# EAGLE schematic MicroMod-Ethernet-Function-Board-W5500 (EAGLE 9.6.2)
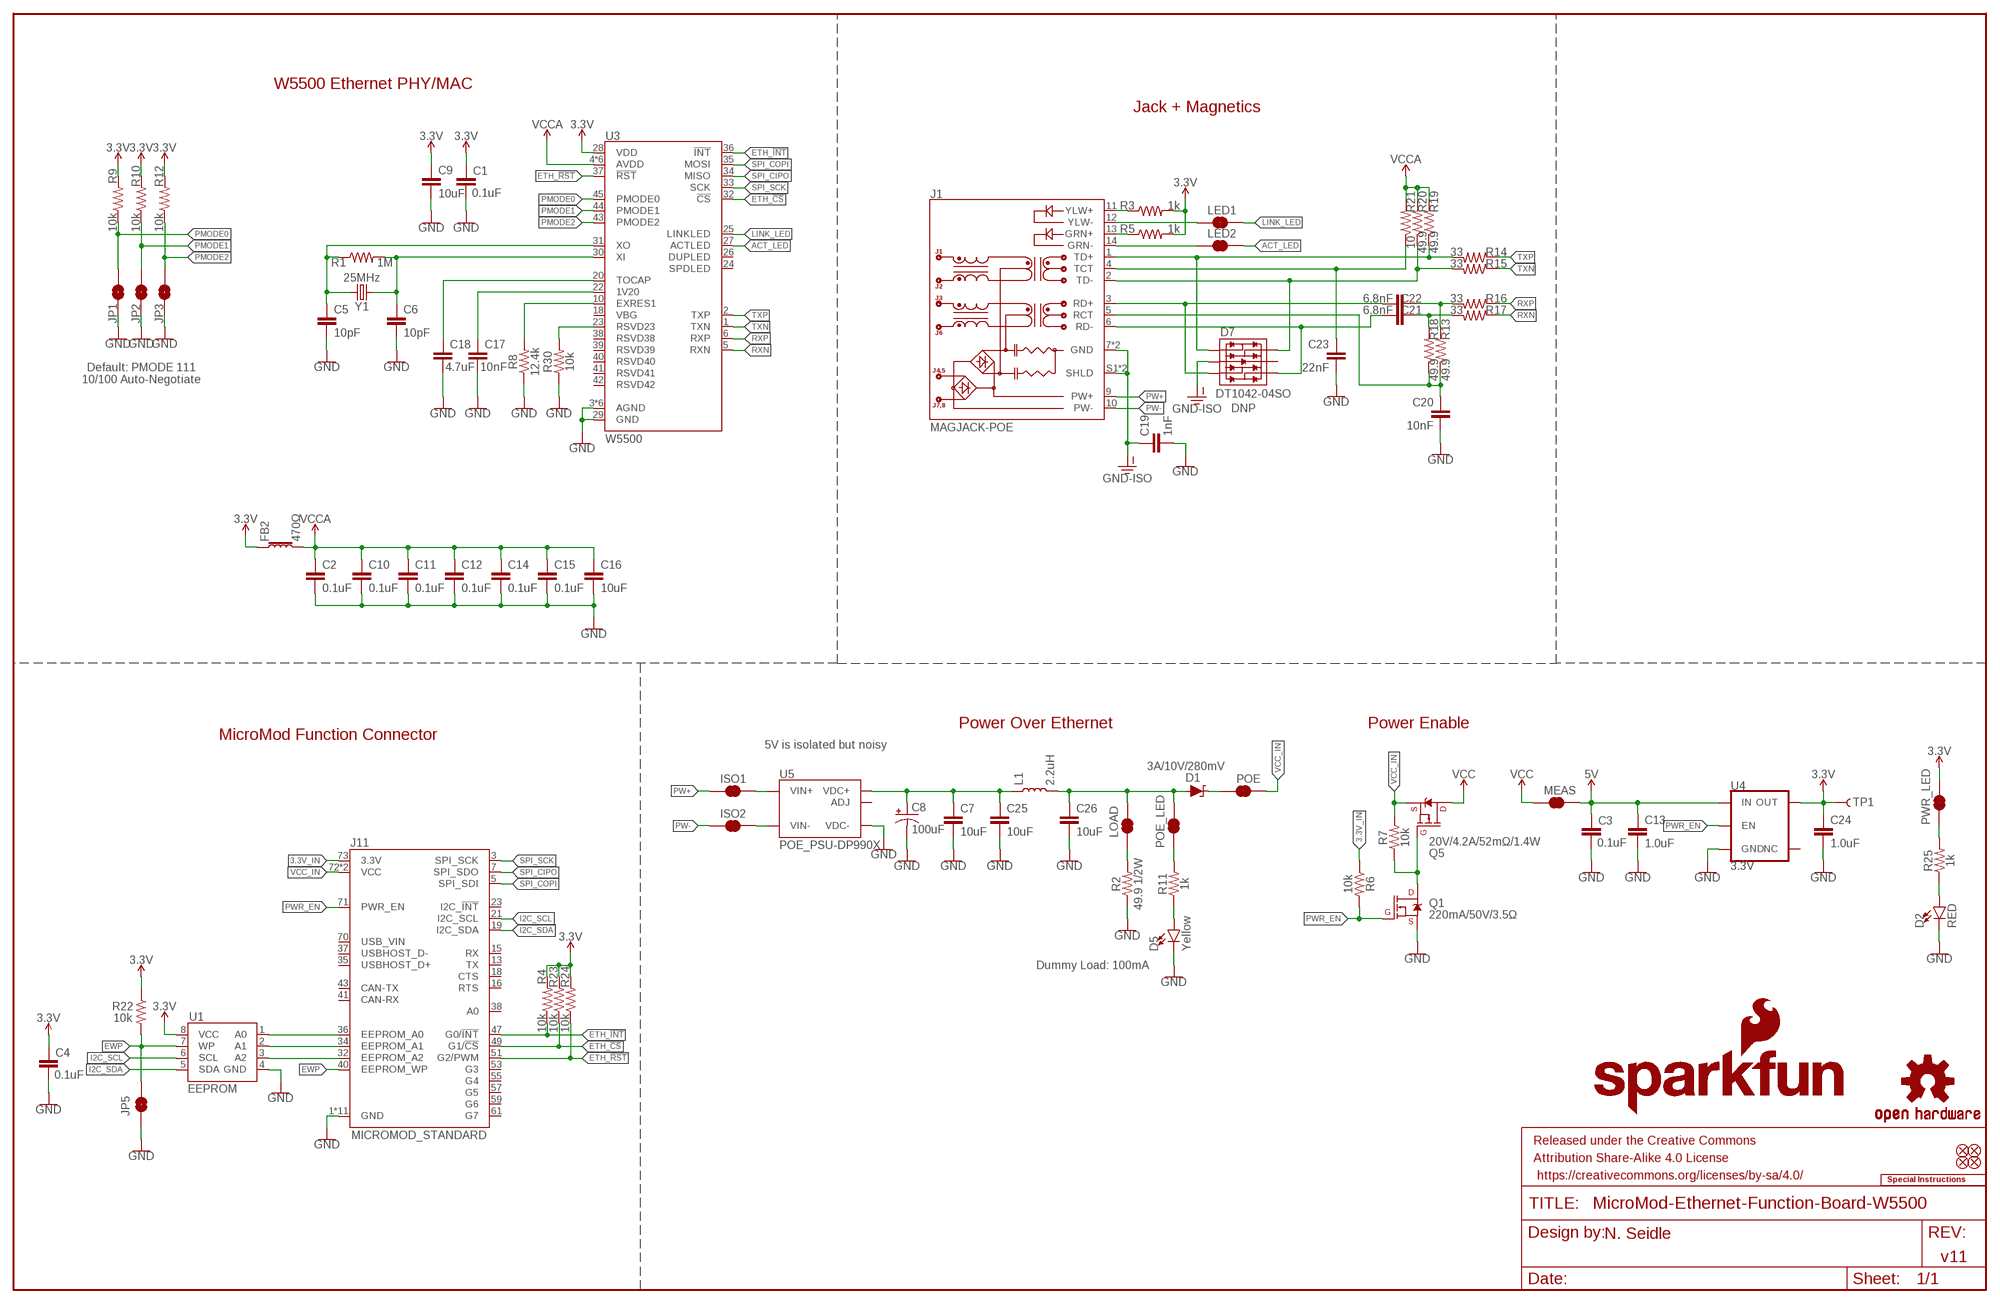
[diagram p0: schematic, sheet 1]

## Parts
C1  0.1uF  0.1UF-0603-25V-(+80/-20%)  [0603]
C2  0.1uF  0.1UF-0603-25V-5%  [0603]
C3  0.1uF  0.1UF-0603-25V-(+80/-20%)  [0603]
C4  0.1uF  0.1UF-0603-25V-(+80/-20%)  [0603]
C5  10pF  10PF-0603-50V-5%  [0603]
C6  10pF  10PF-0603-50V-5%  [0603]
C7  10uF  10UF-0805-25V-10%  [0805]
C8  100uF  100UF-POLAR-25V-20%(ELEC)  [PANASONIC_D]
C9  10uF  10UF-0603-6.3V-20%  [0603]
C10  0.1uF  0.1UF-0603-25V-5%  [0603]
C11  0.1uF  0.1UF-0603-25V-5%  [0603]
C12  0.1uF  0.1UF-0603-25V-5%  [0603]
C13  1.0uF  1.0UF-0603-16V-10%  [0603]
C14  0.1uF  0.1UF-0603-25V-5%  [0603]
C15  0.1uF  0.1UF-0603-25V-5%  [0603]
C16  10uF  10UF-0603-6.3V-20%  [0603]
C17  10nF  10NF-0603-50V-10%  [0603]
C18  4.7uF  4.7UF-0603-6.3V-(10%)  [0603]
C19  1nF  1.0NF/1000PF-1206-2KV-10%  [1206]
C20  10nF  10NF-0603-50V-10%  [0603]
C21  6.8nF  6.8NF/6800PF-0603-50V-5%  [0603]
C22  6.8nF  6.8NF/6800PF-0603-50V-5%  [0603]
C23  22nF  22NF/22,000PF-0603-50V-10%  [0603]
C24  1.0uF  1.0UF-0603-16V-10%-X7R  [0603]
C25  10uF  10UF-0805-25V-10%  [0805]
C26  10uF  10UF-0805-25V-10%  [0805]
D1  3A/10V/280mV  DIODE-SCHOTTKY-BAT60A  [SOD-323]
D2  RED  LED-RED0603  [LED-0603]
D5  Yellow  LED-YELLOW0603  [LED-0603]
D7  DT1042-04SO  TVS_DIODE_ARRAYSMD  [SOT-23-6]
FB2  470Ω  FERRITE_BEAD-0603-470Ω-100MHZ-1A-200MILIΩ  [0603]
FD1  FIDUCIALUFIDUCIAL  [FIDUCIAL-MICRO]
FD2  FIDUCIALUFIDUCIAL  [FIDUCIAL-MICRO]
FD3  FIDUCIALUFIDUCIAL  [FIDUCIAL-MICRO]
FD4  FIDUCIALUFIDUCIAL  [FIDUCIAL-MICRO]
FRAME1  FRAME-LEDGER  [CREATIVE_COMMONS]
ISO1  JUMPER-COMBO_2_NC_TRACE  [COMBO-JUMPER_2_NC_TRACE]
ISO2  JUMPER-COMBO_2_NC_TRACE  [COMBO-JUMPER_2_NC_TRACE]
J1  MAGJACK-POE  [MAGJACK-SYM_LED]
J11  MICROMOD_STANDARD  [M.2-CARD-E-22_FUNCTION_STANDARD]
JP1  JUMPER-SMT_2_NO_SILK  [SMT-JUMPER_2_NO_SILK]
JP2  JUMPER-SMT_2_NO_SILK  [SMT-JUMPER_2_NO_SILK]
JP3  JUMPER-SMT_2_NO_SILK  [SMT-JUMPER_2_NO_SILK]
JP5  JUMPER-SMT_2_NO_SILK  [SMT-JUMPER_2_NO_SILK]
L1  2.2uH  INDUCTOR-0805_WIDE-2.2UH  [0805-WIDE]
LED1  JUMPER-SMT_2_NC_TRACE_SILK  [SMT-JUMPER_2_NC_TRACE_SILK]
LED2  JUMPER-SMT_2_NC_TRACE_SILK  [SMT-JUMPER_2_NC_TRACE_SILK]
LOAD  JUMPER-SMT_2_NC_TRACE_SILK  [SMT-JUMPER_2_NC_TRACE_SILK]
LOGO1  SFE_LOGO_NAME_FLAME.1_INCH  [SFE_LOGO_NAME_FLAME_.1]
LOGO2  SPECIAL_INSTRUCTIONS-ORDERING  [ORDERING_INSTRUCTIONS]
LOGO3  OSHW-LOGOMINI  [OSHW-LOGO-MINI]
MEAS  JUMPER-COMBO_2_NC_TRACE  [COMBO-JUMPER_2_NC_TRACE]
POE  JUMPER-SMT_2_NC_TRACE_SILK  [SMT-JUMPER_2_NC_TRACE_SILK]
POE_LED  JUMPER-SMT_2_NC_TRACE_SILK  [SMT-JUMPER_2_NC_TRACE_SILK]
PWR_LED  JUMPER-SMT_2_NC_TRACE_SILK  [SMT-JUMPER_2_NC_TRACE_SILK]
Q1  220mA/50V/3.5Ω  MOSFET-NCH-BSS138  [SOT23-3]
Q5  20V/4.2A/52mΩ/1.4W  MOSFET_PCH-DMG2305UX-7  [SOT23-3]
R1  1M  1MOHM-0603-1/4W-5%  [0603]
R2  49.9 1/2W  49.9OHM-1206-1/2W-1%  [1206]
R3  1k  1KOHM-0603-1/10W-1%  [0603]
R4  10k  10KOHM-0603-1/10W-1%  [0603]
R5  1k  1KOHM-0603-1/10W-1%  [0603]
R6  10k  10KOHM-0603-1/10W-1%  [0603]
R7  10k  10KOHM-0603-1/10W-1%  [0603]
R8  12.4k  12.4KOHM-0603-1/10W-1%  [0603]
R9  10k  10KOHM-0603-1/10W-1%  [0603]
R10  10k  10KOHM-0603-1/10W-1%  [0603]
R11  1k  1KOHM-0603-1/10W-1%  [0603]
R12  10k  10KOHM-0603-1/10W-1%  [0603]
R13  49.9  49.9OHM-0603-1/10W-1%  [0603]
R14  33  33OHM-0603-1/10W-1%  [0603]
R15  33  33OHM-0603-1/10W-1%  [0603]
R16  33  33OHM-0603-1/10W-1%  [0603]
R17  33  33OHM-0603-1/10W-1%  [0603]
R18  49.9  49.9OHM-0603-1/10W-1%  [0603]
R19  49.9  49.9OHM-0603-1/10W-1%  [0603]
R20  49.9  49.9OHM-0603-1/10W-1%  [0603]
R21  10  10OHM-0603-1/10W-1%  [0603]
R22  10k  10KOHM-0603-1/10W-1%  [0603]
R23  10k  10KOHM-0603-1/10W-1%  [0603]
R24  10k  10KOHM-0603-1/10W-1%  [0603]
R25  1k  1KOHM-0603-1/10W-1%  [0603]
R30  10k  10KOHM-0603-1/10W-1%  [0603]
TP1  TEST-POINT3X4  [PAD.03X.04]
U1  EEPROM  EEPROM-I2C512K  [SO08]
U3  W5500  [LQFP-48]
U4  3.3V  V_REG_AP2112K-3.3V  [SOT23-5]
U5  POE_PSU-DP990X  [DP990X]
Y1  25MHz  CRYSTAL-25MHZ-SMD-2.0X1.6MM  [CRYSTAL-SMD-2.0X1.6MM]

## Nets
3.3V: C1.1 C4.1 C9.1 C24.1 FB2.1 PWR_LED.2 R3.2 R4.2 R5.2 R9.2 R10.2 R12.2 R22.1 R23.2 R24.2 TP1.1 U1.8(VCC) U3.28(VDD) U4.5(OUT)
3.3V_IN: J11.73(3.3V) R6.1
5V: C3.1 C13.1 MEAS.2 MEAS.4 U4.1(IN)
5V_FILTER: C26.1 D1.A L1.2 LOAD.2 POE_LED.2
5V_RAW: C7.1 C8.+ C25.1 L1.1 U5.1(VDC+) U5.2(VDC+)
A0: J11.36(EEPROM_A0) U1.1(A0)
A1: J11.34(EEPROM_A1) U1.2(A1)
A2: J11.32(EEPROM_A2) U1.3(A2)
ACT_LED: LED2.2 U3.27(ACTLED)
ETH_!CS!: J11.49(G1/!CS!) R23.1 U3.32(!CS!)
ETH_!INT!: J11.47(G0/!INT!) R4.1 U3.36(!INT!)
ETH_!RST!: J11.51(G2/PWM) R24.1 U3.37(!RST!)
EWP: J11.40(EEPROM_WP) JP5.2 R22.2 U1.7(WP)
GND: C1.2 C2.2 C3.2 C4.2 C5.2 C6.2 C7.2 C8.- C9.2 C10.2 C11.2 C12.2 C13.2 C14.2 C15.2 C16.2 C17.2 C18.2 C19.2 C20.2 C23.2 C24.2 C25.2 C26.2 D2.C D5.C J11.1(GND) J11.33(GND) J11.39(GND) J11.45(GND) J11.75(GND) J11.GND1(GND) J11.GND2(GND) J11.GND3(GND) J11.GND4(GND) J11.GND5(GND) J11.GND6(GND) JP1.1 JP2.1 JP3.1 JP5.1 Q1.2(S) R2.1 R8.1 R30.1 U1.4(GND) U3.3(AGND) U3.9(AGND) U3.14(AGND) U3.16(AGND) U3.19(AGND) U3.29(GND) U3.48(AGND) U4.2(GND) U5.3(VDC-)
GND-ISO: C19.1 D7.2(VSS) J1.7(GND) J1.8(GND) J1.S1(SHLD) J1.S2(SHLD)
I2C_SCL: J11.21(I2C_SCL) U1.6(SCL)
I2C_SDA: J11.19(I2C_SDA) U1.5(SDA)
LINK_LED: LED1.2 U3.25(LINKLED)
N$1: C5.1 R1.1 U3.31(XO) Y1.1
N$2: C6.1 R1.2 U3.30(XI) Y1.3
N$3: J1.14(GRN-) LED2.1
N$4: J1.12(YLW-) LED1.1
N$5: D5.A R11.1
N$6: POE_LED.1 R11.2
N$7: D1.C POE.1
N$8: J1.13(GRN+) R5.1
N$9: LOAD.1 R2.2
N$10: J1.11(YLW+) R3.1
N$11: Q1.3(D) Q5.1(G) R7.1
N$13: R8.2 U3.10(EXRES1)
N$15: C17.1 U3.22(1V20)
N$16: C18.1 U3.20(TOCAP)
N$17: R30.2 U3.23(RSVD23)
N$19: PWR_LED.1 R25.2
N$20: D2.A R25.1
PMODE0: JP1.2 R9.1 U3.45(PMODE0)
PMODE1: JP2.2 R10.1 U3.44(PMODE1)
PMODE2: JP3.2 R12.1 U3.43(PMODE2)
PW1+: ISO1.2 ISO1.4 U5.5(VIN+) U5.6(VIN+)
PW1-: ISO2.2 ISO2.4 U5.7(VIN-) U5.8(VIN-)
PW+: ISO1.1 ISO1.3 J1.9(PW+)
PW-: ISO2.1 ISO2.3 J1.10(PW-)
PWR_EN: J11.71(PWR_EN) Q1.1(G) R6.2 U4.3(EN)
RCT: C20.1 J1.5(RCT) R13.1 R18.1
RD+: C22.2 D7.3(IO2) J1.3(RD+)
RD-: C21.2 D7.4(IO3) J1.6(RD-)
RXN: R17.1 U3.5(RXN)
RXN1: C21.1 R17.2 R18.2
RXP: R16.1 U3.6(RXP)
RXP1: C22.1 R13.2 R16.2
SPI_CIPO: J11.7(SPI_SDO) U3.34(MISO)
SPI_COPI: J11.5(SPI_SDI) U3.35(MOSI)
SPI_SCK: J11.3(SPI_SCK) U3.33(SCK)
TCT: C23.1 J1.4(TCT) R21.1
TD+: D7.1(IO1) J1.1(TD+) R14.2 R19.1
TD-: D7.6(IO4) J1.2(TD-) R15.2 R20.1
TXN: R15.1 U3.1(TXN)
TXP: R14.1 U3.2(TXP)
VCC: MEAS.1 MEAS.3 Q5.3(D)
VCC_IN: J11.72(VCC) J11.74(VCC) POE.2 Q5.2(S) R7.2
VCCA: C2.1 C10.1 C11.1 C12.1 C14.1 C15.1 C16.1 FB2.2 R19.2 R20.2 R21.2 U3.4(AVDD) U3.8(AVDD) U3.11(AVDD) U3.15(AVDD) U3.17(AVDD) U3.21(AVDD)
Unconnected: D7.5(VCC) J11.13(TX) J11.15(RX) J11.16(RTS) J11.18(CTS) J11.23(I2C_!INT!) J11.35(USBHOST_D+) J11.37(USBHOST_D-) J11.38(A0) J11.41(CAN-RX) J11.43(CAN-TX) J11.53(G3) J11.55(G4) J11.57(G5) J11.59(G6) J11.61(G7) J11.70(USB_VIN) U3.18(VBG) U3.24(SPDLED) U3.26(DUPLED) U3.38(RSVD38) U3.39(RSVD39) U3.40(RSVD40) U3.41(RSVD41) U3.42(RSVD42) U4.4(NC) U5.4(ADJ)

## Notes on the sheet
- W5500 Ethernet PHY/MAC
- Jack + Magnetics
- Default: PMODE 111
  10/100 Auto-Negotiate
- DNP
- Power Over Ethernet | Power Enable
- MicroMod Function Connector
- 5V is isolated but noisy
- Dummy Load: 100mA
- N. Seidle
- v11

## Library data of the parts
C1 C3 C4 = SparkFun-Capacitors:0.1UF: 0.1µF ceramic capacitors A capacitor is a passive two-terminal electrical component used to store electrical energy temporarily in an electric field.; PROD_ID: CAP-00810
C2 C10-C12 C14 C15 = SparkFun-Capacitors:0.1UF: 0.1µF ceramic capacitors A capacitor is a passive two-terminal electrical component used to store electrical energy temporarily in an electric field.; PROD_ID: CAP-08604
C5 C6 = SparkFun-Capacitors:10PF: 10pF ceramic capacitors A capacitor is a passive two-terminal electrical component used to store electrical energy temporarily in an electric field.; PROD_ID: CAP-11812
C7 C25 C26 = SparkFun-Capacitors:10UF: 10.0µF ceramic capacitors A capacitor is a passive two-terminal electrical component used to store electrical energy temporarily in an electric field.; PROD_ID: CAP-14259
C8 = SparkFun-Capacitors:100UF-POLAR: 100µF polarized capacitors A capacitor is a passive two-terminal electrical component used to store electrical energy temporarily in an electric field.; PROD_ID: CAP-12547
C9 C16 = SparkFun-Capacitors:10UF: 10.0µF ceramic capacitors A capacitor is a passive two-terminal electrical component used to store electrical energy temporarily in an electric field.; PROD_ID: CAP-11015
C13 = SparkFun-Capacitors:1.0UF: 1µF ceramic capacitors A capacitor is a passive two-terminal electrical component used to store electrical energy temporarily in an electric field.; PROD_ID: CAP-00868
C17 C20 = SparkFun-Capacitors:10NF: 0.01uF/10nF/10,000pF ceramic capacitors A capacitor is a passive two-terminal electrical component used to store electrical energy temporarily in an electric field. CAP-09321; PROD_ID: CAP-00867
C18 = SparkFun-Capacitors:4.7UF: 4.7µF ceramic capacitors A capacitor is a passive two-terminal electrical component used to store electrical energy temporarily in an electric field.; PROD_ID: CAP-08280
C19 = SparkFun-Capacitors:1.0NF/1000PF: 1nF/1,000pF ceramic capacitors A capacitor is a passive two-terminal electrical component used to store electrical energy temporarily in an electric field.; PROD_ID: CAP-16238
C21 C22 = SparkFun-Capacitors:6.8NF/6800PF: 5.6nF/5600pF ceramic capacitors A capacitor is a passive two-terminal electrical component used to store electrical energy temporarily in an electric field.; PROD_ID: CAP-16239
C23 = SparkFun-Capacitors:22NF/22,000PF: 0.022uF/22nF/22,000pF ceramic capacitors A capacitor is a passive two-terminal electrical component used to store electrical energy temporarily in an electric field.; PROD_ID: CAP-07885
C24 = SparkFun-Capacitors:1.0UF: 1µF ceramic capacitors A capacitor is a passive two-terminal electrical component used to store electrical energy temporarily in an electric field.; PROD_ID: CAP-13930
D1 = SparkFun-DiscreteSemi:DIODE-SCHOTTKY: Schottky diode A Schottky diode is a semiconductor diode which has a low forward voltage drop and a very fast switching action.; PROD_ID: DIO-14072
D2 = SparkFun-LED:LED-RED: Red SMD LED Used in manufacturing of most products at SparkFun Packages: 0603 - SMD 0603 package [Product Link] <http://docs.avagotech.com/docs/AV02-0551EN> 0603 SMART - SMD 0603 SMART package ( more efficient and expensive)[Product Link] <http://www.osram-os.com/Graphics/XPic2/00077099_0.pdf> 1206 - SMD1206 package [Product Link] <https://www.sparkfun.com/datasheets/DevTools/LilyPad/Q150OVS4.pdff> SparkFun Products: Pro Mini 328 -5V <https://www.sparkfun.com/products/821> RedBoard <https://www.sparkfun.com/products/12757> IOIO-OTG <https://www.sparkfun.com/products/13613>; PROD_ID: DIO-00819
D5 = SparkFun-LED:LED-YELLOW: Yellow SMD LED Used in manufacturing several products at SparkFun. Packages: 0603 - SMD 0603 package[Product Link] <http://www.kingbrightusa.com/product.asp?catalog_name=LED&product_id=APT1608SYCK> 0603 -SMART - SMART SMD 0603 package (more efficient/more expensive) [Product Link] <http://www.osram-os.com/osram_os/en/products/product-catalog/led-light-emitting-diodes/smartled-0603/ly-l29k/index.jsp> LilyPad - SMD1206 package[Product Datasheet] <https://www.sparkfun.com/datasheets/DevTools/LilyPad/Q150YUS4.pdf> SparkFun Products: Blynk Board <https://www.sparkfun.com/products/13794> IOIO-OTG <https://www.sparkfun.com/products/13613> XBee Explorer Serial <https://www.sparkfun.com/products/13225>; PROD_ID: DIO-09003
D7 = SparkFun-DiscreteSemi:TVS_DIODE_ARRAY; PROD_ID: IC-13538; VALUE: ESD Diode
FB2 = SparkFun-Coils:FERRITE_BEAD: Ferrite Bead (blocks, cores, rings, chokes, etc.) Inductor with layers of ferrite used to suppress high frequencies. Often used to isolate high frequency noise. SparkFun Products: IOIO-OTG - V2.2 <https://www.sparkfun.com/products/13613> SparkFun SAMD21 Mini Breakout <https://www.sparkfun.com/products/13664> SparkFun 6 Degrees of Freedom Breakout - LSM6DS3 <https://www.sparkfun.com/products/13339> SparkFun SAMD21 Dev Breakout <https://www.sparkfun.com/products/13672>; PROD_ID: NDUC-12579
FD1-FD4 = SparkFun-Aesthetics:FIDUCIAL: Fiducial Alignment Points Point-of-reference for pick-and-place machines and other optical instruments.
FRAME1 = SparkFun-Aesthetics:FRAME-LEDGER: Schematic Frame - Ledger Standard 11x14 US Ledger frame
ISO1 ISO2 MEAS = SparkFun-Jumpers:JUMPER-COMBO_2_NC_TRACE
J1 = SparkFun-Connectors:MAGJACK-POE: MAGJACK: RJ-45 with POE and LEDs This is a single port, RJ45 ethernet jacks with built in transformer (magnetics), PoE rectifier diodes, status LEDs, and shielding.; PROD_ID: CONN-16253
J11 = SparkFun-MicroMod-Function:MICROMOD: MicroMod Connector Description: A card edge connector and mating PCB connector to allow various MicroMod Processor Boards to be coupled with various carrier boards of different capabilities. Based on the M.2 standard.
JP1-JP3 JP5 = SparkFun-Jumpers:JUMPER-SMT_2_NO: Normally open jumper This jumper has two pads in close proximity to each other. Apply solder to close the connection. Round pads are easier to solder for beginners, but are a lot larger. SparkFun Product that uses the round pads: SparkFun EL Sequencer <https://www.sparkfun.com/products/12781>
L1 = SparkFun-Coils:INDUCTOR: Inductors Resist changes in electrical current. Basically a coil of wire. SparkFun Products: SparkFun Load Cell Amplifier - HX711 <https://www.sparkfun.com/products/13879> IOIO-OTG - V2.2 <https://www.sparkfun.com/products/13613>; PROD_ID: NDUC-14234
LED1 LED2 LOAD POE POE_LED PWR_LED = SparkFun-Jumpers:JUMPER-SMT_2_NC_TRACE: Normally closed trace jumper This jumper has a trace between two pads so it's normally closed (NC). Use a razor knife to open the connection. For best results follow the IPC guidelines for cutting traces: Cutout at least 0.063 mm (0.005 in). Remove all loose material to clean up the cut area. Seal the cut with an approved epoxy. Reapply solder to reclose the connection.
LOGO1 = SparkFun-Aesthetics:SFE_LOGO_NAME_FLAME: SparkFun Font Logo w/ Flame This is the SparkFun full logo. The logo on the schematic will always be the same size; the package variant is the height of the flame part of the logo. Default layer for the logo on the board is tSilk.
LOGO2 = SparkFun-Aesthetics:SPECIAL_INSTRUCTIONS: Special Ordering/Production Instructions Alert Symbol for special PCB ordering instructions or unique production process warnings. Ordering Instructions Production Instructions Types of information that should be added to box: Copper weight Soldermask color Silk color PCB thickness Number of layers PCB Standard: 1.6mm FR4 1 oz copper immersion silver plating red soldermask white silkscreen Types of information that should be added to box: Special wash requirements Depaneling instructions Humidification Glue curing Default text settings: 0.07 inch 9% ratio 50% line distance
LOGO3 = SparkFun-Aesthetics:OSHW-LOGO: Open-Source Hardware (OSHW) Logo This logo indicates the piece of hardware it is found on incorporates a OSHW license and/or adheres to the definition of open source hardware found here: http://freedomdefined.org/OSHW
Q1 = SparkFun-DiscreteSemi:MOSFET-NCH: N-channel MOSFETs Voltage controlled devices that allow control of high current outputs. SparkFun Products: SparkFun OpenScale <https://www.sparkfun.com/products/13261> SparkFun Digital Sandbox <https://www.sparkfun.com/products/12651> SparkFun Monster Moto Shield <https://www.sparkfun.com/products/10182> SparkFun MOSFET Power Controller <https://www.sparkfun.com/products/11214>; PROD_ID: TRANS-00830
Q5 = SparkFun-DiscreteSemi:MOSFET_PCH: P-channel MOSFETs Voltage controlled devices that allow control of high current outputs. SparkFun Products: SparkFun ESP32 Thing <https://www.sparkfun.com/products/13907> SparkFun ESP8266 Thing <https://www.sparkfun.com/products/13231> SparkFun Pi Servo HAT V2 <https://www.sparkfun.com/products/15316> DMG2305UX-7 (20V/4.2A/SOT23-3); PROD_ID: TRANS-14388
R1 = SparkFun-Resistors:1MOHM: 1MΩ resistor A resistor is a passive two-terminal electrical component that implements electrical resistance as a circuit element. Resistors act to reduce current flow, and, at the same time, act to lower voltage levels within circuits. - Wikipedia; PROD_ID: RES-07868
R2 = SparkFun-Resistors:49.9OHM: 49.9Ω resistor A resistor is a passive two-terminal electrical component that implements electrical resistance as a circuit element. Resistors act to reduce current flow, and, at the same time, act to lower voltage levels within circuits. - Wikipedia; PROD_ID: RES-16252
R3 R5 R11 R25 = SparkFun-Resistors:1KOHM: 1kΩ resistor A resistor is a passive two-terminal electrical component that implements electrical resistance as a circuit element. Resistors act to reduce current flow, and, at the same time, act to lower voltage levels within circuits. - Wikipedia; PROD_ID: RES-07856
R4 R6 R7 R9 R10 R12 R22-R24 R30 = SparkFun-Resistors:10KOHM: 10kΩ resistor A resistor is a passive two-terminal electrical component that implements electrical resistance as a circuit element. Resistors act to reduce current flow, and, at the same time, act to lower voltage levels within circuits. - Wikipedia; PROD_ID: RES-00824
R8 = SparkFun-Resistors:12.4KOHM: 12.4kΩ resistor A resistor is a passive two-terminal electrical component that implements electrical resistance as a circuit element. Resistors act to reduce current flow, and, at the same time, act to lower voltage levels within circuits. - Wikipedia; PROD_ID: RES-16236
R13 R18-R20 = SparkFun-Resistors:49.9OHM: 49.9Ω resistor A resistor is a passive two-terminal electrical component that implements electrical resistance as a circuit element. Resistors act to reduce current flow, and, at the same time, act to lower voltage levels within circuits. - Wikipedia; PROD_ID: RES-16237
R14-R17 = SparkFun-Resistors:33OHM: 33Ω resistor A resistor is a passive two-terminal electrical component that implements electrical resistance as a circuit element. Resistors act to reduce current flow, and, at the same time, act to lower voltage levels within circuits. - Wikipedia; PROD_ID: RES-08270
R21 = SparkFun-Resistors:10OHM: 10Ω resistor A resistor is a passive two-terminal electrical component that implements electrical resistance as a circuit element. Resistors act to reduce current flow, and, at the same time, act to lower voltage levels within circuits. - Wikipedia; PROD_ID: RES-12581
TP1 = SparkFun-Connectors:TEST-POINT: SparkFun Test Points Bare copper test points for troubleshooting or In-Circuit-Testing. These are used by our Production team for verifying production board runs using pogo-pins on test beds. SparkFun Products: SparkFun LSM9DS1 Breakout <https://www.sparkfun.com/products/13284> SparkFun PSOC <https://www.sparkfun.com/products/13714> SparkFun Load Cell Amplifier <https://www.sparkfun.com/products/13879>
U1 = SparkFun-IC-Memory:EEPROM-I2C: I2C EEPROMs, 24LC256 and others 24LC256 Series 256 kb I2C 2 Wire (32 k x 8 Bit) 2.5 V Serial EEPROM SMD - SOIC-8 Datasheet SparkFun Products SparkFun UDB5 - PIC UAV Development Board <https://www.sparkfun.com/products/11703> (GPS-11703); PROD_ID: IC-14645
U3 = SparkFun-IC-Comms:W5500; PROD_ID: IC-16240
U4 = SparkFun-IC-Power:V_REG_AP2112: AP2112 - 600mA CMOS LDO Regulator w/ Enable The AP2112 is CMOS process low dropout linear regulator with enable function, the regulator delivers a guaranteed 600mA (min.) continuous load current. Features Output Voltage Accuracy: ±1.5% Output Current: 600mA (Min.) Foldback Short Current Protection: 50mA Enable Function to Turn ON/OFF VOUT Low Dropout Voltage (3.3V): 250mV (Typ.) @IOUT=600mA Excellent Load Regulation: 0.2%/A (Typ.) Excellent Line Regulation: 0.02%/V (Typ.) Low Quiescent Current: 55μA (Typ.) Low Standby Current: 0.01μA (Typ.) Low Output Noise: 50μVRMS PSRR: 100Hz -65dB, 1kHz -65dB OTSD Protection Stable with 1.0μF Flexible Cap: Ceramic, Tantalum and Aluminum Electrolytic Operation Temperature Range: -40°C to 85°C ESD: MM 400V, HBM 4000V; PROD_ID: VREG-12457
U5 = SparkFun-IC-Power:POE_PSU: A special function Power Over Ethernet module with 5V or 12V output. Comes in an SMD package.; PROD_ID: IC-16251
Y1 = SparkFun-Clocks:CRYSTAL-25MHZ: 25MHz Crystal; PROD_ID: XTAL-16235

## Net classes
0 default: width 0 mm, drill 0 mm
1 vcc: width 0 mm